# EAGLE schematic MyPi (EAGLE 7.0.0)
Portable Handheld Retropie with a 5 inch screen
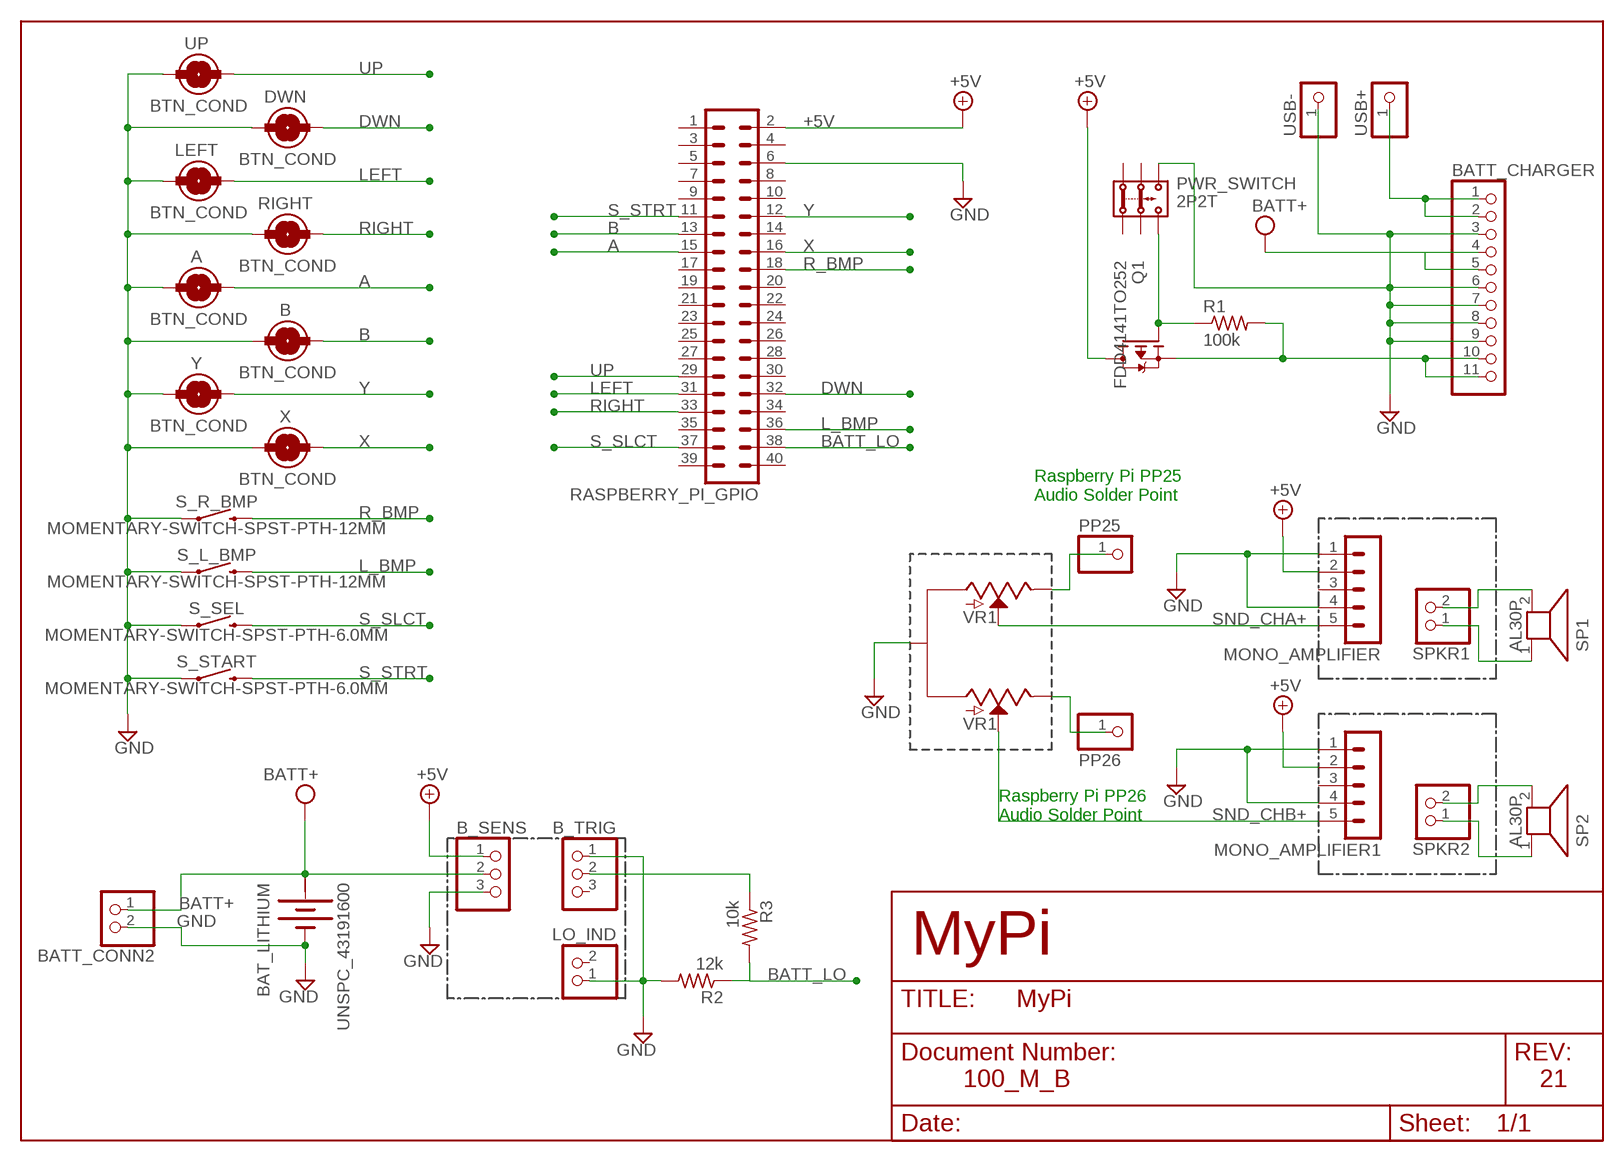
[diagram p0: schematic, sheet 1]

## Parts
A  BTN_COND  [BUTTON-CONDUCTIVE-GC]
B  BTN_COND  [BUTTON-CONDUCTIVE-GC]
B_SENS  PINHD-1X3  [1X03]
B_TRIG  PINHD-1X3  [1X03]
BAT_LITHIUM  UNSPC_43191600  BATTERY  [BATTERY]
BATT_CHARGER  PINHD-1X11  [1X11]
BATT_CONN2  JST_2PIN-THM-RA  [JST-PH-2-THM-RA]
DWN  BTN_COND  [BUTTON-CONDUCTIVE-GC]
LEFT  BTN_COND  [BUTTON-CONDUCTIVE-GC]
LO_IND  JST_2PIN-THM-RA  [JST-PH-2-THM-RA]
MONO_AMPLIFIER  MA05-1  [MA05-1]
MONO_AMPLIFIER1  MA05-1  [MA05-1]
PP25  PINHD-1X1  [1X01]
PP26  PINHD-1X1  [1X01]
PWR_SWITCH  2P2T  [2P2T]
Q1  FDD4141TO252  [TO252]
R1  100k  R-US_R2512  [R2512]
R2  12k  R-US_R2512  [R2512]
R3  10k  R-US_R2512  [R2512]
RASPBERRY_PI_GPIO  MA20-2  [MA20-2]
RIGHT  BTN_COND  [BUTTON-CONDUCTIVE-GC]
S_L_BMP  MOMENTARY-SWITCH-SPST-PTH-12MM  [TACTILE_SWITCH_PTH_12MM]
S_R_BMP  MOMENTARY-SWITCH-SPST-PTH-12MM  [TACTILE_SWITCH_PTH_12MM]
S_SEL  MOMENTARY-SWITCH-SPST-PTH-6.0MM  [TACTILE_SWITCH_PTH_6.0MM]
S_START  MOMENTARY-SWITCH-SPST-PTH-6.0MM  [TACTILE_SWITCH_PTH_6.0MM]
SP1  AL30P  [AL30P]
SP2  AL30P  [AL30P]
SPKR1  PINHD-1X2  [1X02]
SPKR2  PINHD-1X2  [1X02]
UP  BTN_COND  [BUTTON-CONDUCTIVE-GC]
USB+  PINHD-1X1  [1X01]
USB-  PINHD-1X1  [1X01]
VR1  POTENTIOMETER_DUAL-PTH-12MM-1/20W-20%  [POT-DUAL-PTH-UXCELL]
X  BTN_COND  [BUTTON-CONDUCTIVE-GC]
Y  BTN_COND  [BUTTON-CONDUCTIVE-GC]

## Nets
+5V: B_SENS.1 MONO_AMPLIFIER1.2 MONO_AMPLIFIER.2 Q1.3(D) RASPBERRY_PI_GPIO.2
A: A.2 RASPBERRY_PI_GPIO.15
B: B.2 RASPBERRY_PI_GPIO.13
BATT+: B_SENS.2 BAT_LITHIUM.+ BATT_CHARGER.4 BATT_CHARGER.5 BATT_CONN2.1
BATT_LO: R2.1 R3.2 RASPBERRY_PI_GPIO.38
DWN: DWN.2 RASPBERRY_PI_GPIO.32
GND: A.1 B.1 B_SENS.3 B_TRIG.1 BAT_LITHIUM.- BATT_CHARGER.3 BATT_CHARGER.6 BATT_CHARGER.7 BATT_CHARGER.8 BATT_CHARGER.9 BATT_CONN2.2 DWN.1 LEFT.1 LO_IND.1 MONO_AMPLIFIER1.1 MONO_AMPLIFIER1.4 MONO_AMPLIFIER.1 MONO_AMPLIFIER.4 PWR_SWITCH.3.1 R2.2 RASPBERRY_PI_GPIO.6 RIGHT.1 S_L_BMP.1 S_R_BMP.1 S_SEL.1 S_START.1 UP.1 USB-.1 VR1.COM(A) X.1 Y.1
L_BMP: RASPBERRY_PI_GPIO.36 S_L_BMP.3
LEFT: LEFT.2 RASPBERRY_PI_GPIO.31
N$1: SP2.1 SPKR2.1
N$2: SP2.2 SPKR2.2
N$3: SP1.1 SPKR1.1
N$4: SP1.2 SPKR1.2
N$5: PP25.1 VR1.A_IN
N$6: B_TRIG.2 R3.1
N$8: PP26.1 VR1.B_IN
N$9: BATT_CHARGER.10 BATT_CHARGER.11 Q1.2(S) R1.2
N$10: PWR_SWITCH.3.2 Q1.1(G) R1.1
R_BMP: RASPBERRY_PI_GPIO.18 S_R_BMP.3
RIGHT: RASPBERRY_PI_GPIO.33 RIGHT.2
S_SLCT: RASPBERRY_PI_GPIO.37 S_SEL.3
S_STRT: RASPBERRY_PI_GPIO.11 S_START.3
SND_CHA+: MONO_AMPLIFIER.5 VR1.A_OUT
SND_CHB+: MONO_AMPLIFIER1.5 VR1.B_OUT
UP: RASPBERRY_PI_GPIO.29 UP.2
USB+: BATT_CHARGER.1 BATT_CHARGER.2 USB+.1
X: RASPBERRY_PI_GPIO.16 X.2
Y: RASPBERRY_PI_GPIO.12 Y.2
Unconnected: B_TRIG.3 LO_IND.2 MONO_AMPLIFIER1.3 MONO_AMPLIFIER.3 PWR_SWITCH.1.1 PWR_SWITCH.1.2 PWR_SWITCH.2.1 PWR_SWITCH.2.2 RASPBERRY_PI_GPIO.1 RASPBERRY_PI_GPIO.3 RASPBERRY_PI_GPIO.4 RASPBERRY_PI_GPIO.5 RASPBERRY_PI_GPIO.7 RASPBERRY_PI_GPIO.8 RASPBERRY_PI_GPIO.9 RASPBERRY_PI_GPIO.10 RASPBERRY_PI_GPIO.14 RASPBERRY_PI_GPIO.17 RASPBERRY_PI_GPIO.19 RASPBERRY_PI_GPIO.20 RASPBERRY_PI_GPIO.21 RASPBERRY_PI_GPIO.22 RASPBERRY_PI_GPIO.23 RASPBERRY_PI_GPIO.24 RASPBERRY_PI_GPIO.25 RASPBERRY_PI_GPIO.26 RASPBERRY_PI_GPIO.27 RASPBERRY_PI_GPIO.28 RASPBERRY_PI_GPIO.30 RASPBERRY_PI_GPIO.34 RASPBERRY_PI_GPIO.35 RASPBERRY_PI_GPIO.39 RASPBERRY_PI_GPIO.40

## Notes on the sheet
- Raspberry Pi PP25
  Audio Solder Point
- Raspberry Pi PP26
  Audio Solder Point
- MyPi
- 21
- 100_M_B

## Power pins joined to a net without a drawn wire
+: BAT_LITHIUM.+@1(+)

## Library data of the parts
A B DWN LEFT RIGHT UP X Y = Conductive-Switches:BTN_COND
B_SENS B_TRIG = PINHEAD:PINHD-1X3: PIN HEADER
BAT_LITHIUM = special:BATTERY: BATTERY
BATT_CHARGER = PINHEAD:PINHD-1X11: PIN HEADER
BATT_CONN2 LO_IND = adafruit:JST_2PIN: JST 2-Pin Connectors of various flavors SMT-RA (S2B-PH-SM4) 4UConnector #17311 SMT (B2B-PH-SM4) THM-RA (S2B-PH) THM (B2B-PH)
MONO_AMPLIFIER MONO_AMPLIFIER1 = con-lstb:MA05-1: PIN HEADER; OC_FARNELL: unknown; OC_NEWARK: unknown
PP25 PP26 USB+ USB- = PINHEAD:PINHD-1X1: PIN HEADER
PWR_SWITCH = switch:2P2T: SLIDE SWITCH 2P2T Part No. SS-22F05-G(A)4 Source: CANAL ELECTRONIC CO., LTD .. switsch.pdf
Q1 = transistor-fet:FDD4141: P-Channel PowerTrench® MOSFET Source: FDD4141.pdf
R1-R3 = rcl:R-US_: RESISTOR, American symbol
RASPBERRY_PI_GPIO = con-lstb:MA20-2: PIN HEADER; OC_FARNELL: unknown; OC_NEWARK: unknown
S_L_BMP S_R_BMP = SparkFun-Switches:MOMENTARY-SWITCH-SPST: Momentary Switch (Pushbutton) - SPST Normally-open (NO) SPST momentary switches (buttons, pushbuttons). Variants PTH-12MM - 12mm square, through-hole Momentary Pushbutton Switch - 12mm Square <https://www.sparkfun.com/products/9190> (COM-09190) PTH-6.0MM, PTH-6.0MM-KIT - 6.0mm square, through-hole Mini Pushbutton Switch <https://www.sparkfun.com/products/97> (COM-00097) KIT package intended for soldering kit's - only one side of pads' copper is exposed. PTH-RIGHT-ANGLE-KIT - Right-angle, through-hole Right Angle Tactile Button <https://www.sparkfun.com/products/10791> - Used on SparkFun BigTime Watch Kit <https://www.sparkfun.com/products/11734> SMD-12MM - 12mm square, surface-mount Tactile Button - SMD (12mm) <https://www.sparkfun.com/products/12993> (COM-12993) Used on SparkFun PicoBoard <https://www.sparkfun.com/products/11888> SMD-4.5MM - 4.5mm Square Trackball Switch Used on SparkFun Blackberry Trackballer Breakout <https://www.sparkfun.com/products/13169> SMD-4.6MMX2.8MM - 4.60mm x 2.80mm, surface mount Used on SparkFun SAMD21 Mini Breakout <https://www.sparkfun.com/products/13664> SMD-5.2MM, SMD-5.2-REDUNDANT - 5.2mm square, surface-mount Mini Pushbutton Switch - SMD <https://www.sparkfun.com/products/8720> (COM-08720) Used on Arduino Pro Mini <https://www.sparkfun.com/products/11114> REDUNDANT package connects both switch circuits together SMD-6.0X3.5MM - 6.0 x 3.5mm, surface mount Momentary Reset Switch SMD <https://www.sparkfun.com/products/8229> (COM-08229) SMD-6.2MM-TALL - 6.2mm square, surface mount Tactile Button - SMD (6mm) <https://www.sparkfun.com/products/12992> Used on SparkFun Digital Sandbox <https://www.sparkfun.com/products/12651> SMD-RIGHT-ANGLE - Right-angle, surface mount Used on SparkFun Block for Intel� Edison - Arduino <https://www.sparkfun.com/products/13036>; PROD_ID: SWCH-09185; SF_SKU: COM-09190
S_SEL S_START = SparkFun-Switches:MOMENTARY-SWITCH-SPST: Momentary Switch (Pushbutton) - SPST Normally-open (NO) SPST momentary switches (buttons, pushbuttons). Variants PTH-12MM - 12mm square, through-hole Momentary Pushbutton Switch - 12mm Square <https://www.sparkfun.com/products/9190> (COM-09190) PTH-6.0MM, PTH-6.0MM-KIT - 6.0mm square, through-hole Mini Pushbutton Switch <https://www.sparkfun.com/products/97> (COM-00097) KIT package intended for soldering kit's - only one side of pads' copper is exposed. PTH-RIGHT-ANGLE-KIT - Right-angle, through-hole Right Angle Tactile Button <https://www.sparkfun.com/products/10791> - Used on SparkFun BigTime Watch Kit <https://www.sparkfun.com/products/11734> SMD-12MM - 12mm square, surface-mount Tactile Button - SMD (12mm) <https://www.sparkfun.com/products/12993> (COM-12993) Used on SparkFun PicoBoard <https://www.sparkfun.com/products/11888> SMD-4.5MM - 4.5mm Square Trackball Switch Used on SparkFun Blackberry Trackballer Breakout <https://www.sparkfun.com/products/13169> SMD-4.6MMX2.8MM - 4.60mm x 2.80mm, surface mount Used on SparkFun SAMD21 Mini Breakout <https://www.sparkfun.com/products/13664> SMD-5.2MM, SMD-5.2-REDUNDANT - 5.2mm square, surface-mount Mini Pushbutton Switch - SMD <https://www.sparkfun.com/products/8720> (COM-08720) Used on Arduino Pro Mini <https://www.sparkfun.com/products/11114> REDUNDANT package connects both switch circuits together SMD-6.0X3.5MM - 6.0 x 3.5mm, surface mount Momentary Reset Switch SMD <https://www.sparkfun.com/products/8229> (COM-08229) SMD-6.2MM-TALL - 6.2mm square, surface mount Tactile Button - SMD (6mm) <https://www.sparkfun.com/products/12992> Used on SparkFun Digital Sandbox <https://www.sparkfun.com/products/12651> SMD-RIGHT-ANGLE - Right-angle, surface mount Used on SparkFun Block for Intel� Edison - Arduino <https://www.sparkfun.com/products/13036>; PROD_ID: SWCH-08441; SF_SKU: COM-00097
SP1 SP2 = buzzer:AL30P: SPEAKER Source: Buerklin; OC_FARNELL: unknown; OC_NEWARK: unknown
SPKR1 SPKR2 = PINHEAD:PINHD-1X2: PIN HEADER
VR1 = VolumeControl:POTENTIOMETER_DUAL: Potentiometer (Pot) Dual-Gang Three-terminal potentiometers, with an adjustable wiper and two adjustable resistors. A pot can be used to create a configurable voltage divider, or as a variable resistor. This is a dua-gang pot - it includes two separate circuits, both controlled by one wiper. Variants PTH-12MM and PTH-12MM-KIT - 12mm Square, PTH Vertical Pots Used on the SparkFun SparkPunk Sound Kit <https://www.sparkfun.com/products/11177> (filter control) The KIT variant exposes copper on only one side of the PTH pad, so the part can only be assembled on one side of the PCB. Useful for beginner soldering kits.; PROD_ID: RES-11897